# Altium schematic sheet Block Diagram.SchDoc
size A4; SheetNumber: 1; SheetTotal: 4
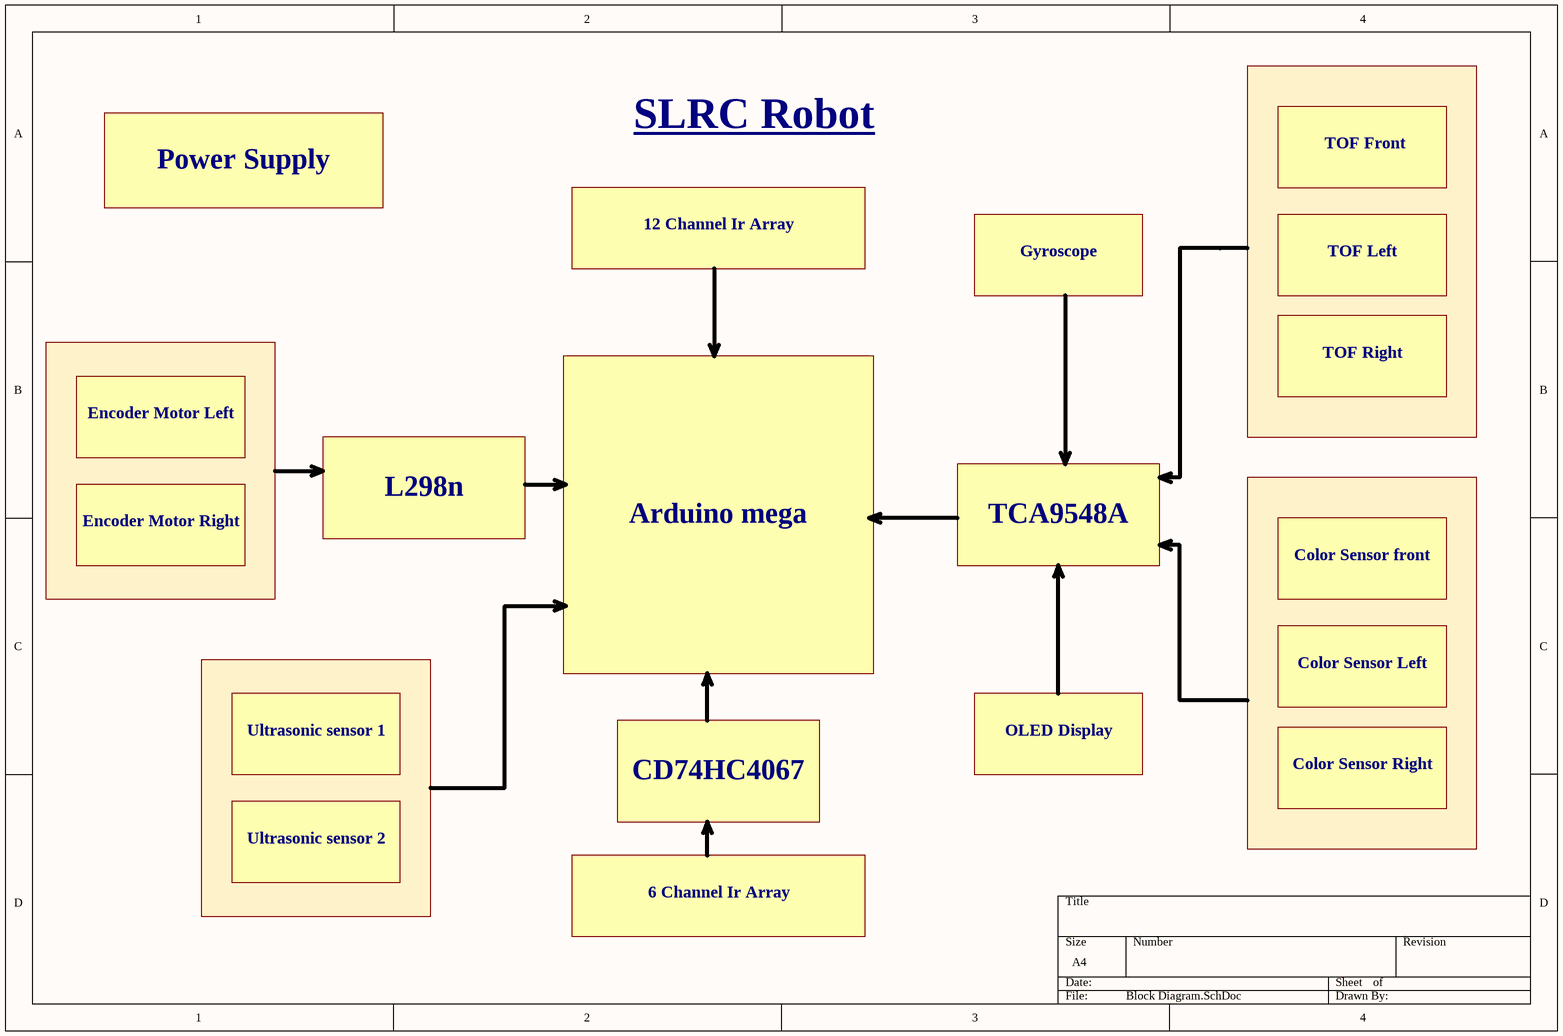
[diagram p0: Block Diagram.SchDoc]

## Notes on the sheet
- SLRC Robot
- Power Supply
- TOF Front
- 12 Channel Ir Array
- Gyroscope
- TOF Left
- TOF Right
- Encoder Motor Left
- L298n
- Encoder Motor Right
- Arduino mega
- TCA9548A
- Color Sensor front
- Color Sensor Left
- Ultrasonic sensor 1
- CD74HC4067
- OLED Display
- Color Sensor Right
- Ultrasonic sensor 2
- 6 Channel Ir Array